# EAGLE design band-dsp-teensy (EAGLE 7.7.0)
DATABASE: /Users/ingolia/Dropbox/Experiments/turbidostat/nephelometer/circuitry/partsdb.txt
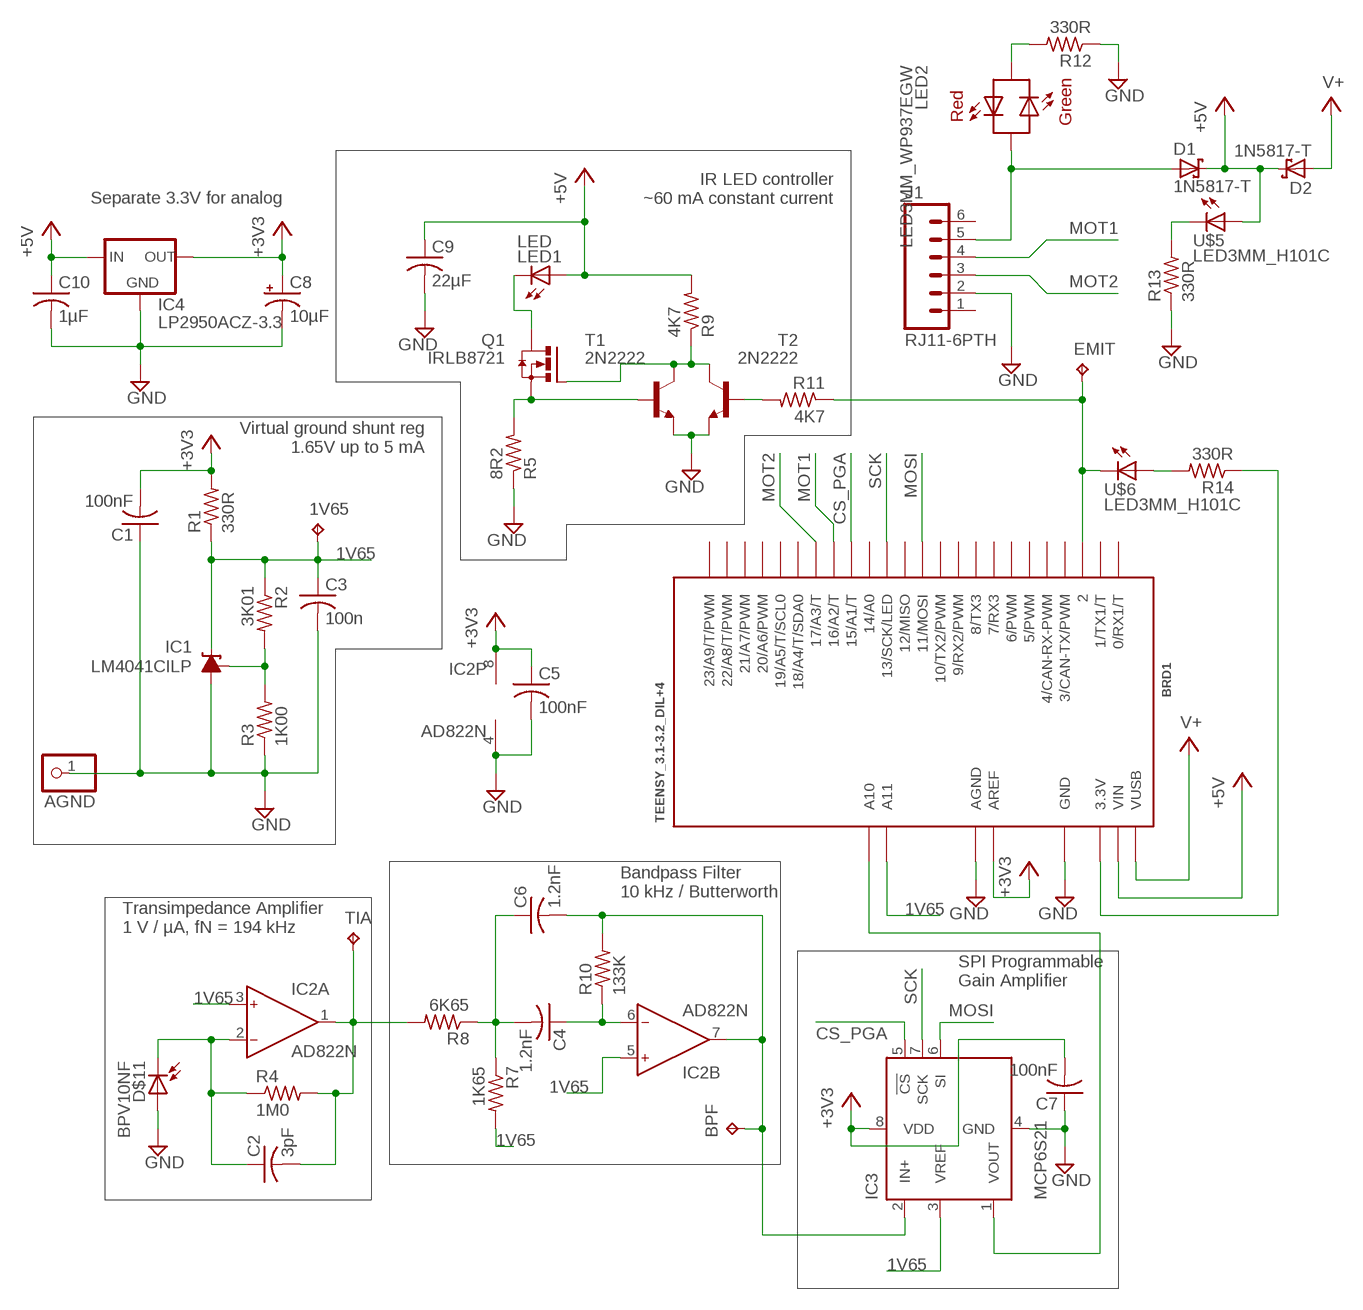
[diagram p0: schematic, sheet 1]

## Parts
1V65  TPTP10R  [TP10R]
AGND  PINHD-1X1  [1X01]
BPF  TPTP10R  [TP10R]
BRD1  TEENSY_3.1-3.2_DIL+4  [TEENSY_3.0-3.2&LC_DIL+4]
C1  100nF  C-US025-025X050  [C025-025X050]
C2  3pF  C-US025-024X044  [C025-024X044]
C3  100n  C-US025-025X050  [C025-025X050]
C4  1.2nF  C-US025-025X050  [C025-025X050]
C5  100nF  C-US025-025X050  [C025-025X050]
C6  1.2nF  C-US025-025X050  [C025-025X050]
C7  100nF  C-US025-025X050  [C025-025X050]
C8  10µF  CPOL-USE2.5-5  [E2,5-5]
C9  22µF  C-US050-045X075  [C050-045X075]
C10  1µF  C-US025-030X050  [C025-030X050]
D1  1N5817-T  [DO41-7.6]
D2  1N5817-T  [DO41-7.6]
D$11  BPV10NF  [LED5MM]
EMIT  TPPAD1-13  [P1-13]
IC1  LM4041CILP  [LP_O-PBCY-W3]
IC2  AD822N  [DIL08]
IC3  MCP6S21  [DIL08]
IC4  LP2950ACZ-3.3  [TO92]
J1  RJ11-6PTH  [RJ11-6]
LED1  LED  1X02_3.5MM_LED  [1X02_3.5MM]
LED2  LED3MM_WP937EGW  [LED3MM_H101C_BICOL]
Q1  IRLB8721  IRLB8721HORIZONTAL  [TO220BH]
R1  330R  R-US_0207/9  [0207/9]
R2  3K01  R-US_0207/9  [0207/9]
R3  1K00  R-US_0207/9  [0207/9]
R4  1M0  R-US_0207/9  [0207/9]
R5  8R2  R-US_0207/9  [0207/9]
R7  1K65  R-US_0207/9  [0207/9]
R8  6K65  R-US_0207/9  [0207/9]
R9  4K7  R-US_0207/9  [0207/9]
R10  133K  R-US_0207/9  [0207/9]
R11  4K7  R-US_0207/9  [0207/9]
R12  330R  R-US_0207/9  [0207/9]
R13  330R  R-US_0207/9  [0207/9]
R14  330R  R-US_0207/9  [0207/9]
T1  2N2222  [TO92-EBC-OVAL]
T2  2N2222  [TO92-EBC-OVAL]
TIA  TPTP10R  [TP10R]
U$5  LED3MM_H101C  [LED3MM_H101C]
U$6  LED3MM_H101C  [LED3MM_H101C]

## Nets
1V65: 1V65.TP BRD1.A11 C3.1 IC1.2(C) IC2.3(A:IN+) IC2.5(B:IN+) IC3.3(VREF) R1.1 R2.1 R7.2
+3V3: BRD1.AREF C1.2 C5.1 C7.2 C8.+ IC2.8(P:V+) IC3.8(VDD) IC4.1(OUT) R1.2
+5V: BRD1.VIN C9.1 C10.1 D1.C D2.C IC4.3(IN) LED1.1A(A) R9.2 U$5.A
CS_PGA: BRD1.15/A1(15/A1/T) IC3.5(!CS)
GND: AGND.1 BRD1.AGND BRD1.GND C1.1 C3.2 C5.2 C7.1 C8.- C9.2 C10.2 D$11.A IC1.3(A) IC2.4(P:V-) IC3.4(GND) IC4.2(GND) J1.2 R3.1 R5.1 R12.1 R13.1 T1.E T2.E
LEDCTRL: R11.2 T2.B
MOSI: BRD1.11(11/MOSI) IC3.6(SI)
MOT1: BRD1.16/A2(16/A2/T) J1.4
MOT2: BRD1.17/A3(17/A3/T) J1.3
N$1: C2.1 D$11.K IC2.2(A:IN-) R4.1
N$2: BRD1.3.3V R14.1
N$3: C4.2 C6.1 R7.1 R8.1
N$4: BRD1.A10 IC3.1(VOUT)
N$5: BRD1.2 EMIT.TP R11.1 U$6.K
N$6: BPF.TP C6.2 IC2.7(B:OUT) IC3.2(IN+) R10.2
N$7: R13.2 U$5.K
N$8: Q1.G R9.1 T1.C T2.C
N$9: C4.1 IC2.6(B:IN-) R10.1
N$10: D1.A J1.5 LED2.SHORT(GA)
N$11: R14.2 U$6.A
N$12: LED2.LONG(GK) R12.2
N$14: Q1.S R5.2 T1.B
N$18: LED1.2K(K) Q1.D
N$22: C2.2 IC2.1(A:OUT) R4.2 R8.2 TIA.TP
N$35: IC1.1(FB) R2.2 R3.2
SCK: BRD1.13(13/SCK/LED) IC3.7(SCK)
V+: BRD1.VUSB D2.A
Unconnected: BRD1.0(0/RX1/T) BRD1.1(1/TX1/T) BRD1.3(3/CAN-TX/PWM) BRD1.4(4/CAN-RX-PWM) BRD1.5(5/PWM) BRD1.6(6/PWM) BRD1.7(7/RX3) BRD1.8(8/TX3) BRD1.9(9/RX2/PWM) BRD1.10(10/TX2/PWM) BRD1.12(12/MISO) BRD1.14/A0 BRD1.18/A4(18/A4/T/SDA0) BRD1.19/A5(19/A5/T/SCL0) BRD1.20/A6(20/A6/PWM) BRD1.21/A7(21/A7/PWM) BRD1.22/A8(22/A8/T/PWM) BRD1.23/A9(23/A9/T/PWM) J1.1 J1.6

## Notes on the sheet
- Separate 3.3V for analog
- IR LED controller
  ~60 mA constant current
- Virtual ground shunt reg
  1.65V up to 5 mA
- Bandpass Filter
  10 kHz / Butterworth
- Transimpedance Amplifier
  1 V / µA, fN = 194 kHz
- SPI Programmable
  Gain Amplifier

## Library data of the parts
1V65 BPF EMIT TIA = testpad:TP: Test pad
AGND = adafruit:PINHD-1X1: Pin header 1x1 for 0.1" spacing With round pins
BRD1 = Teensy_3_and_LC_Series_Boards_v1.4:TEENSY_3.1-3.2_DIL+4: Teensy 3.1 and 3.2 in a DIL package with the inner 4 pins; DIGIKEY#: 1568-1231-ND; DIGIKEY2#: 300-1002-ND; DIGIKEY3#: SAM1198-14-ND; DIGIKEY4#: SAM1198-14-ND; DIGIKEY5#: S7038-ND; DIGIKEY6#: S7047-ND; DIGIKEY7#: S7047-ND; MANF: SparkFun Electronics; MANF#: DEV-13736; MANF2: Citizen Finedevice Co Ltd; MANF2#: CFS-20632768DZFB; MANF3: Samtec Inc.; MANF3#: SSQ-114-03-G-S; MANF4: Samtec Inc.; MANF4#: SSQ-114-03-G-S; MANF5: Sullins Connector Solutions; MANF5#: PPPC051LFBN-RC; MANF6: Sullins Connector Solutions; MANF6#: PPPC141LFBN-RC; MANF7: Sullins Connector Solutions; MANF7#: PPPC141LFBN-RC
C1 C3 C5 C7 = adafruit:C-US: CAPACITOR, American symbol; DIGIKEY#: BC1084CT-ND; MANF: Vishay BC Components; MANF#: K104K15X7RF5TL2
C2 = adafruit:C-US: CAPACITOR, American symbol; DIGIKEY#: 445-8377-ND; MANF: TDK Corporation; MANF#: FK18C0G1H030C
C4 C6 = adafruit:C-US: CAPACITOR, American symbol; DIGIKEY#: BC1026CT-ND; MANF: Vishay BC Components; MANF#: K122J15C0GF5TL2
C8 = adafruit:CPOL-US: POLARIZED CAPACITOR, American symbol; DIGIKEY#: 478-8042-1-ND; MANF: AVX Corporation; MANF#: TAP106K016SRW
C9 = adafruit:C-US: CAPACITOR, American symbol; DIGIKEY#: 445-8455-ND; MANF: TDK Corporation; MANF#: FK20X7R1C226M
C10 = adafruit:C-US: CAPACITOR, American symbol; DIGIKEY#: 445-5318-ND; MANF: TDK Corporation; MANF#: FK14X7R1C105K
D1 D2 = diode:1N581*: 1.0A SCHOTTKY BARRIER RECTIFIER Source: http://www.diodes.com/datasheets/ds23001.pdf; DIGIKEY#: 1N5817FSCT-ND; MANF: Fairchild Semiconductor; MANF#: 1N5817
D$11 = ingolia:BPV10NF; DIGIKEY#: 751-1002-ND; MANF: Vishay Semiconductor Opto Division; MANF#: BPV10NF
IC1 = texas:LM4041*I: PRECISION MICROPOWER SHUNT VOLTAGE REFERENCE Adjustable Output Source: http://focus.ti.com/lit/ds/slcs146e/slcs146e.pdf; DIGIKEY#: 296-22173-1-ND; MANF: Texas Instruments; MANF#: LM4041CILPR; MPN: LM4041CILP; OC_FARNELL: 1673945; OC_NEWARK: 50M8856
IC2 = analog-devices:AD822: Single-Supply, Rail-to-Rail Low Power FET-Input Op Amp Source: http://www.analog.com/static/imported-files/data_sheets/AD822.pdf; DIGIKEY#: AD823ANZ-ND; MANF: Analog Devices Inc.; MANF#: AD823ANZ; OC_FARNELL: 1438581; OC_NEWARK: unknown
IC3 = ingolia:MCP6S21; DIGIKEY#: MCP6S91-E/P-ND; MANF: Microchip Technology; MANF#: MCP6S91-E/P
IC4 = v-reg:LP2950?*: Source: http://cache.national.com/ds/LP/LP2950.pdf; DIGIKEY#: LP2950ACZ-3.3/NOPB-ND; MANF: Texas Instruments; MANF#: LP2950ACZ-3.3/NOPB
J1 = SparkFun-Connectors:RJ11-6: RJ11 Jack Simple 6 pin RJ11 jack. Commonly found on CAT3 devices and Microchip programmers. SKU: PRT-00132; DIGIKEY#: AE10383-ND; MANF: Assmann WSW Components; MANF#: A-2004-1-4-LP-N-R
LED1 = ingolia:1X02_3.5MM_LED; DIGIKEY#: 475-3002-ND; DIGIKEY2#: 492-1502-ND; DIGIKEY3#: ED2740-ND; MANF: OSRAM Opto Semiconductors Inc; MANF#: SFH 4547; MANF2: Bivar Inc; MANF2#: CR-174; MANF3: On Shore Technology Inc.; MANF3#: OSTTE020104
LED2 = ingolia:LED3MM_WP937EGW; DIGIKEY#: 754-1751-ND; DIGIKEY2#: 492-1789-ND; MANF: Kingbright; MANF#: WP937EGW; MANF2: Bivar Inc.; MANF2#: H-101C
Q1 = ingolia:IRLB8721; DIGIKEY#: IRLB8721PBF-ND; MANF: Infineon Technologies; MANF#: IRLB8721PBF
R1 R12 R13 = adafruit:R-US_: RESISTOR, American symbol; DIGIKEY#: CF14JT330RCT-ND; MANF: Stackpole Electronics Inc.; MANF#: CF14JT330R
R2 = adafruit:R-US_: RESISTOR, American symbol; DIGIKEY#: RNF14FTD3K01CT-ND; MANF: Stackpole Electronics Inc.; MANF#: RNF14FTD3K01
R3 = adafruit:R-US_: RESISTOR, American symbol; DIGIKEY#: RNF14FTD1K00CT-ND; MANF: Stackpole Electronics Inc.; MANF#: RNF14FTD1K00
R4 = adafruit:R-US_: RESISTOR, American symbol; DIGIKEY#: RNV14FAL1M00CT-ND; MANF: Stackpole Electronics Inc; MANF#: RNV14FAL1M00
R5 = adafruit:R-US_: RESISTOR, American symbol; DIGIKEY#: S8.2HCT-ND; MANF: Stackpole Electronics Inc.; MANF#: CFM12JT8R20
R7 = adafruit:R-US_: RESISTOR, American symbol; DIGIKEY#: 1.65KXBK-ND; MANF: Yageo; MANF#: MFR-25FBF52-1K65
R8 = adafruit:R-US_: RESISTOR, American symbol; DIGIKEY#: 6.65KXBK-ND; MANF: Yageo; MANF#: MFR-25FBF52-6K65
R9 R11 = adafruit:R-US_: RESISTOR, American symbol; DIGIKEY#: CF14JT4K70CT-ND; MANF: Stackpole Electronics Inc; MANF#: CF14JT4K70
R10 = adafruit:R-US_: RESISTOR, American symbol; DIGIKEY#: 133KXBK-ND; MANF: Yageo; MANF#: MFR-25FBF52-133K
R14 = adafruit:R-US_: RESISTOR, American symbol; DIGIKEY#: CF14JT150RCT-ND; MANF: Stackpole Electronics Inc.; MANF#: CF14JT150R
T1 T2 = adafruit:2N2222: NPN TRANSISTOR Big oval pads; DIGIKEY#: PN2222ATFCT-ND; MANF: Fairchild Semiconductor; MANF#: PN2222ATF
U$5 = ingolia:LED3MM_H101C; DIGIKEY#: 754-1595-ND; DIGIKEY2#: 492-1789-ND; MANF: Kingbright; MANF#: WP710A10CGCK; MANF2: Bivar Inc.; MANF2#: H-101C
U$6 = ingolia:LED3MM_H101C; DIGIKEY#: 754-1727-ND; DIGIKEY2#: 492-1789-ND; MANF: Kingbright; MANF#: WP710A10SYD; MANF2: Bivar Inc.; MANF2#: H-101C

## Board
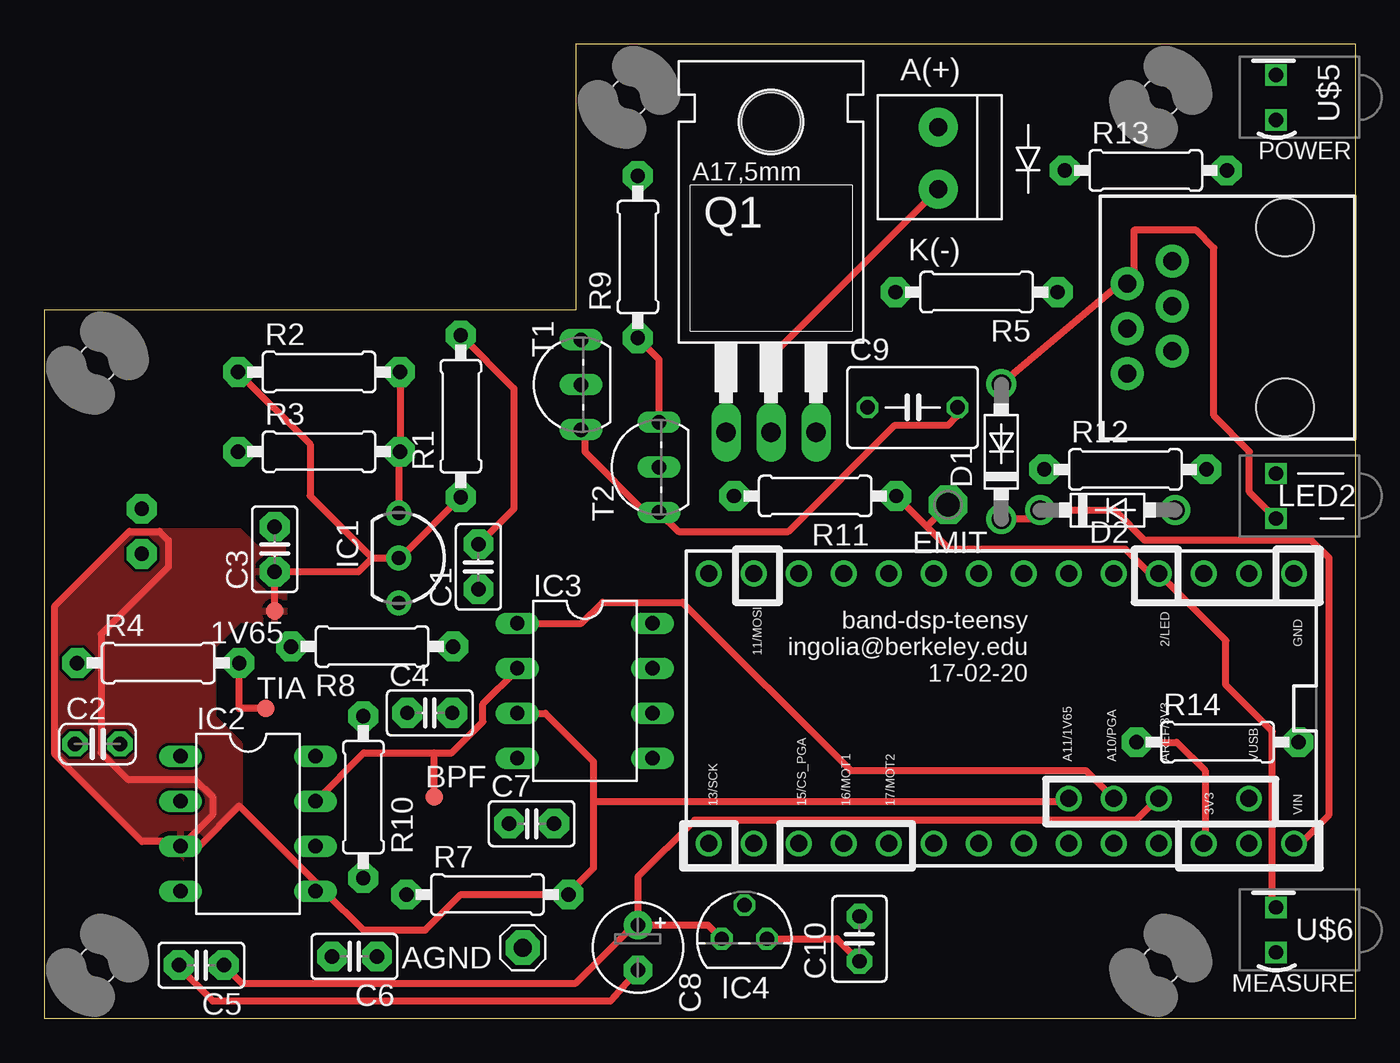
[diagram p1: board, top side]
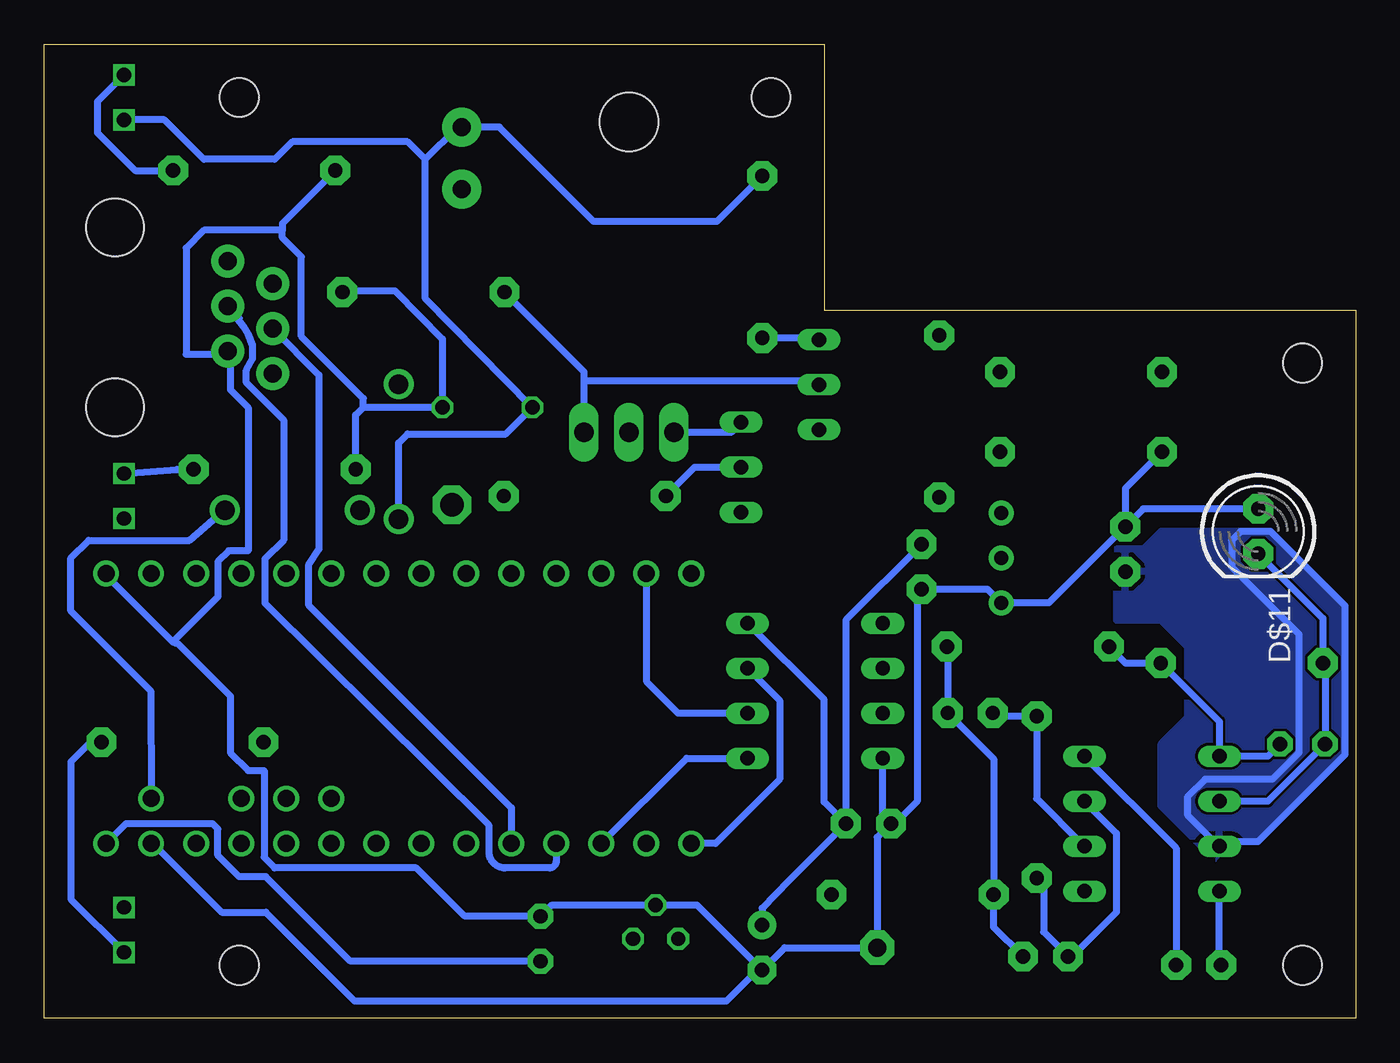
[diagram p2: board, bottom side, seen from below]

Size 74 x 55 mm. Coordinates in mm from the lower left corner, seen from the top.
Outline: 0,0 74,0 74,55 30,55 30,40 0,40 0,0
Copper layers (1*16): Top 0.0356mm / dielectric 1.5011mm / Bottom 0.0356mm
Design rules "oshpark-2layer": minimum track width 6mil, minimum drill 13mil, track to track 6mil, track to pad 6mil, pad to pad 6mil, via to via 6mil, smd to smd 6mil, copper to edge 15mil, drill to drill 6mil, minimum pad ring 7mil, minimum via ring 7mil, stop-mask expansion 2.5mil, vias tented up to drill 0mil, thermal gap 10mil

### Footprints (pad centres in the part's own frame; a part is rotated, then mirrored left to right if it is on the bottom)
TP10R = smd 1 x 1: TP 0,0
1X01 = drill 1.016 pad 1.93 octagon: 1 0,0
TEENSY_3.0-3.2&LC_DIL+4 = drill 0.965: 0 -7.62,13.97; 1 -7.62,11.43; 2 -7.62,8.89; 3 -7.62,6.35; 3.3V 7.62,11.43; 4 -7.62,3.81; 5 -7.62,1.27; 6 -7.62,-1.27; 7 -7.62,-3.81; 8 -7.62,-6.35; 9 -7.62,-8.89; 10 -7.62,-11.43; 11 -7.62,-13.97; 12 -7.62,-16.51; 13 7.62,-16.51; 14/A0 7.62,-13.97; 15/A1 7.62,-11.43; 16/A2 7.62,-8.89; 17/A3 7.62,-6.35; 18/A4 7.62,-3.81; 19/A5 7.62,-1.27; 20/A6 7.62,1.27; 21/A7 7.62,3.81; 22/A8 7.62,6.35; 23/A9 7.62,8.89; A10 5.08,6.35; A11 5.08,3.81; AGND 7.62,13.97; AREF 5.08,8.89; GND -7.62,16.51; VIN 7.62,16.51; VUSB 5.08,13.97
C025-025X050 = drill 0.813 pad 1.676 octagon: 1 -1.27,0; 2 1.27,0
C025-024X044 = drill 0.813 pad 1.422 octagon: 1 -1.27,0; 2 1.27,0
E2,5-5 = drill 0.813 pad 1.6: + -1.27,0 | drill 0.813 pad 1.6 octagon: - 1.27,0
C050-045X075 = drill 0.813 octagon: 1 -2.54,0; 2 2.54,0
C025-030X050 = drill 0.813 pad 1.422 octagon: 1 -1.27,0; 2 1.27,0
DO41-7.6 = drill 1.1 pad 1.7: A 3.81,0; C -3.81,0
LED5MM = drill 0.813 pad 1.676 octagon: A -1.27,0; K 1.27,0
P1-13 = drill 1.321 pad 2.159 octagon: TP 0,0
LP_O-PBCY-W3 = drill 0.8 pad 1.4: 1 -2.54,0; 2 0,0; 3 2.54,0
DIL08 = drill 0.813 long: 1 -3.81,-3.81; 2 -1.27,-3.81; 3 1.27,-3.81; 4 3.81,-3.81; 5 3.81,3.81; 6 1.27,3.81; 7 -1.27,3.81; 8 -3.81,3.81
TO92 = drill 0.813 octagon: 1 -1.27,0; 2 0,1.905; 3 1.27,0
RJ11-6 = drill 1.016 pad 1.88: 1 1.905,8.89; 2 3.175,6.35; 3 4.445,8.89; 4 5.715,6.35; 5 6.985,8.89; 6 8.255,6.35 | hole 3.251: 0,0; 10.16,0
1X02_3.5MM = drill 1 pad 2.184: 1A 1.8,0; 2K -1.7,0
LED3MM_H101C_BICOL = drill 0.8 square: LONG -1.27,0; SHORT 1.27,0
TO220BH = drill 1.118 long: D 0,-10.16; G -2.54,-10.16; S 2.54,-10.16 | hole 3.302: 0,7.366
0207/9 = drill 0.813 pad 1.676 octagon: 1 -4.572,0; 2 4.572,0
TO92-EBC-OVAL = drill 0.813 long: B 0,-1.27; C 2.54,-1.27; E -2.54,-1.27
M2MOUNT = hole 2.2: 0,0
LED3MM_H101C = drill 0.8 square: A 1.27,0; K -1.27,0

### Placement (x,y rotation side)
1V65  13,23 180 top
AGND  27,4 0 top
BPF  22,12.5 0 top
BRD1  54,17.5 270 top
C1  24.5,25.5 90 top
C2  3,15.5 0 top
C3  13,26.5 90 top
C4  21.75,17.25 0 top
C5  8.86,3.01 180 top
C6  17.5,3.5 180 top
C7  27.5,11 0 top
C8  33.5,4 270 top
C9  49,34.5 0 top
C10  46,4.5 90 top
D1  54,32 90 top
D2  60,28.7 0 top
D$11  5.5,27.5 270 bottom
EMIT  51,29 0 top
IC1  20,26 270 top
IC2  11.5,11 270 top
IC3  30.5,18.5 270 top
IC4  39.5,4.5 0 top
J1  70,34.5 90 top
LED1  50.44,48.52 90 top
LED2  69.5,29.5 270 top
Q1  41.01,43.25 0 top
R1  23.5,34 90 top
R2  15.5,36.5 0 top
R3  15.5,32 0 top
R4  6.43,20.07 0 top
R5  52.61,41.01 180 top
R7  25,7 0 top
R8  18.5,21 180 top
R9  33.49,42.99 90 top
R10  18,12.5 270 top
R11  43.5,29.5 180 top
R12  61,31 0 top
R13  62.16,47.88 0 top
R14  66.2,15.6 0 top
T1  29.02,35.78 90 top
T2  33.41,31.12 90 top
TIA  12.5,17.5 0 top
U$1  [M2MOUNT]  3,3 0 top
U$2  [M2MOUNT]  63,52 0 top
U$3  [M2MOUNT]  63,3 0 top
U$4  [M2MOUNT]  3,37 0 top
U$5  69.5,52 270 top
U$6  69.5,5 270 top
U$7  [M2MOUNT]  33,52 0 top

### Tracks (layer width: path | path; a pad name or v marks a point on that pad's centre or on a via)
1V65
  Top 0.406: R2.1 15,32.43 15,29.5 18.5,26 | 18.5,26 IC1.2 20.07,26 R1.1 | 26.69,17.19 IC3.3 28.27,17.23 31,14.5 31,12.25 | 31,12.25 31,8.5 29.57,7.07 R7.2 23.5,7 21.5,5 18,5 15.81,7.19 IC2.5 15.31,7.69 11,12 8.73,9.73 IC2.3 | 31,12.25 57.64,12.25 BRD1.A11 | 18.5,26 17.73,25.23 C3.1 1V65.TP | 0.6,23.3 4.8,27.5 6.5,27.5 7,27 7,25.5 3.2,21.7 3.2,15 4.7,13.5 8.5,13.5 9.5,12.5 9.5,11.5 8,10 5.5,10 0.6,14.9 0.6,23.3
  Bottom 0.406: 6.5,27.5 7,27 7,25.5 3.2,21.7 3.2,15 4.7,13.5 8.5,13.5 9.5,12.5 9.5,11.5 8,10 5.5,10 0.6,14.9 0.6,23.3 4.8,27.5 6.5,27.5
  pour Top: 0.6,23.3 4.8,27.5 11,27.5 12,26.5 13.5,26.5 13.5,22.5 11,22.5 9.5,21 9.5,17 11,15.5 11,12 8,9 7,10 5.5,10 0.6,14.9
  pour Bottom: 0.6,23.3 4.8,27.5 11,27.5 12,26.5 13.5,26.5 13.5,22.5 11,22.5 9.5,21 9.5,17 11,15.5 11,12 8,9 7,10 5.5,10 0.6,14.9
+3V3
  Top 0.406: R1.2 26.5,35.57 26.5,28.77 C1.2 | BRD1.AREF 62.82,12.42 61.6,11.2 36.7,11.2 33.5,8 C8.+ | IC4.1 37.46,5.27 C8.+ | C5.1 11.14,2 30,2 33.27,5.27 C8.+
  Bottom 0.406: IC2.8 10.13,9.63 C5.1 | IC3.8 30,18 30,12.23 C7.2 | C1.2 28.77,22.5 C7.2 | C8.+ 33.5,6.23 32,7.77 C7.2
+5V
  Top 0.406: BRD1.VIN 71,10 72.5,11.5 72.5,26 71.5,27 62.1,27 60.4,28.7 D2.C 56.18,28.19 D1.C | IC4.3 44.73,4.5 C10.1
  Bottom 0.406: 52.5,48.5 52.5,40.64 C9.1 47.96,33 53.5,33 54,32.5 D1.C | 52.5,48.5 50.68,50.32 LED1.1A 48.32,50.32 43,45 36.05,45 R9.2 | 52.5,48.5 53.5,49.5 60,49.5 61,48.5 65,48.5 67.23,50.73 U$5.A | C10.1 56.73,3.23 61.5,8 63,8 64.2,9.2 64.2,10.7 64.5,11 69.39,11 BRD1.VIN
CS_PGA
  Bottom 0.406: BRD1.15/A1 37.76,14.69 IC3.5
GND
  Top 0.406: C5.2 7.59,2.91 9.5,1 31.96,1 C8.- | C9.2 51.5,34 51,33.5 48,33.5 42,27.5 35.76,27.5 T2.E 33.92,28.58 30.5,32 30.5,33.03 T1.E
  Bottom 0.406: R3.1 13,29.93 C3.2 | 60.57,44.5 65,44.5 66,43.5 66,37.5 63.83,37.5 | 66.75,21.25 70.51,25.01 BRD1.GND | 66.75,21.25 66.6,21.2 66.5,21.2 63.5,18.2 63.5,15 62.5,14 61.6,14 61.6,9.1 61,8.5 53,8.5 50.27,5.77 C10.2 45.37,6.4 IC4.2 37.17,6.4 C8.- | C1.1 20.77,24.23 IC1.3 17.31,23.46 C3.2 | J1.2 63.83,37.5 | 63.83,37.5 63.5,37.5 63.5,35.5 62.5,34.5 62.5,26.4 63.6,26.4 64.2,25.8 64.2,23.8 66.75,21.25 | C5.2 7.69,3.11 IC2.4 | C7.1 26.69,11.46 IC3.4 | C7.1 26,11 24.75,12.25 24.75,23.98 C1.1 | 24.5,24 C1.1 | 60.57,44.5 60.57,44.07 59.5,43 59.5,38.5 56,35 56,34.5 | 57,41 57,41.01 R5.1 57.18,41.07 54.2,41.07 51.54,38.37 C9.2 56,34.5 | R12.1 56.43,34.07 56,34.5 | R13.1 60.57,44.89 60.57,44.5 | C8.- 33.73,3 | BRD1.AGND 67.88,9.88 64,6 61.5,6 56.5,1 35.5,1 33.77,2.73 C8.- | D$11.A 12,28.77 C3.2 | C8.- 32.23,4 AGND.1 27,10.23 C7.1
LEDCTRL
  Bottom 0.406: R11.2 37.31,31.12 T2.B
MOSI
  Bottom 0.406: IC3.6 38.23,17.23 40,19 40,25.09 BRD1.11
MOT1
  Bottom 0.406: BRD1.16/A2 45.11,8.89 arc90 45.5,8.5 48,8.5 arc90 48.9,9.4 48.9,10.9 61.55,23.45 61.55,25.95 60.5,27 60.5,33.8 62.6,35.9 62.6,36.6 62.25,37.25 62.25,38 62.5,38.65 62.75,39.06 J1.4 63.65,40.15 63,39.5 63,39.56
MOT2
  Bottom 0.406: J1.3 58.5,36.34 58.5,26.5 59.1,25.6 59.1,23.35 47.65,11.9 BRD1.17/A3
N$1
  Bottom 0.406: D$11.K 1.86,22.59 R4.1 1.73,19.94 C2.1 4.96,12.27 IC2.2
N$2
  Top 0.406: R14.1 63.9,15.6 65.5,14 65.5,9.95 BRD1.3.3V
N$3
  Bottom 0.406: C6.1 20.43,5.16 R7.1 20.43,14.66 C4.2 23.02,20.95 R8.1
N$4
  Top 0.406: IC3.1 30.31,22.31 31.5,23.5 36,23.5 45.5,14 58.77,14 BRD1.A10
N$5
  Top 0.406: R11.1 49.79,27.79 | 49.79,27.79 51.07,26.5 61,26.5 62.38,25.12 BRD1.2 66.67,21.34 66.67,18.82 69.3,16.2 69.3,6.34 69.5,6.14 U$6.K | EMIT.TP 49.79,27.79
N$6
  Top 0.406: IC2.7 18.04,15 22,15 | 22,15 23,15 24.75,16.75 24.75,17.75 26.69,19.69 IC3.2 | BPF.TP 22,15
  Bottom 0.406: 15.27,12.27 IC2.7 13.5,10.46 13.5,6 16,3.5 C6.2 17.61,4.88 17.61,7.54 R10.2
N$7
  Bottom 0.406: U$5.K 71,51.77 71,50 68.88,47.88 R13.2
N$8
  Top 0.406: R9.1 34.68,37.23 T2.C
  Bottom 0.406: T1.C 30.39,38.42 R9.1 | T2.C 35.25,33.09 Q1.G
N$9
  Bottom 0.406: IC2.6 18,12.42 R10.1 20.3,17.07 C4.1
N$10
  Top 0.406: D1.A 60.48,41.3 60.48,41.48 J1.5 61.5,41.88 61.5,44.5 65,44.5 66,43.5 66,34.04 68,32 68,29.73 LED2.SHORT
N$11
  Bottom 0.406: R14.2 71.4,15.6 72.5,14.5 72.5,6.73 U$6.A
N$12
  Bottom 0.406: LED2.LONG 66.5,31 R12.2
N$14
  Bottom 0.406: R5.2 43.55,36.52 43.55,36 | 43.55,36 Q1.S | T1.B 30.51,36 43.55,36
N$18
  Top 0.406: LED1.2K 41.01,37.39 Q1.D
N$22
  Top 0.406: TIA.TP 11,17.5 R4.2
  Bottom 0.406: C2.2 4.96,14.81 IC2.1 7.69,16.76 R4.2 | R4.2 11.07,20 | R8.2 13,20.07 R4.2
N$35
  Top 0.406: R2.2 R3.2 20,31.93 IC1.1
SCK
  Bottom 0.406: IC3.7 32.5,17.96 32.5,13.5 36.12,9.88 BRD1.13
V+
  Bottom 0.406: D2.A 65.8,27 71.5,27 72.5,26 72.5,23 68,18.5 BRD1.VUSB

### Text on the board
tPlace: POWER | band-dsp-teensy / ingolia@berkeley.edu / 17-02-20 | 11/MOSI | 2/LED | GND | A11/1V65 | A10/PGA | AREF/3V3 | VUSB | 13/SCK | 15/CS_PGA | 16/MOT1 | 17/MOT2 | 3V3 | VIN | MEASURE